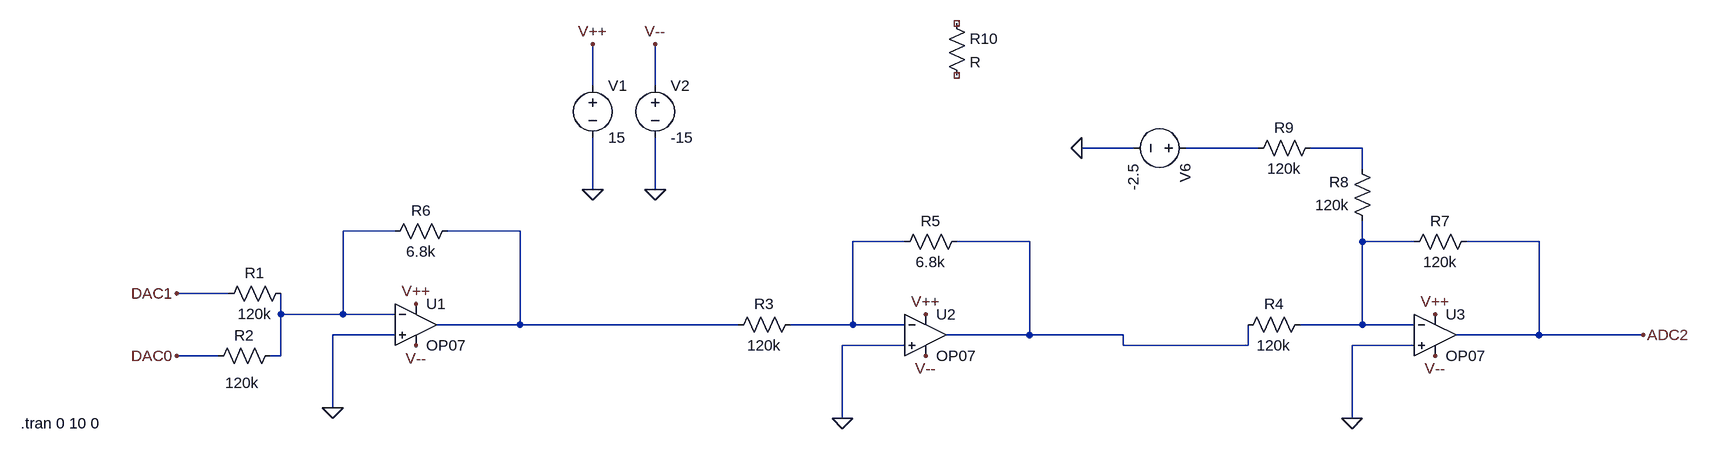
[diagram p0: schematic K_Circuit.asc]
K_Circuit.asc, the LTspice schematic file:
Version 4
SHEET 1 2016 680
WIRE 320 -272 320 -336
WIRE 416 -272 416 -336
WIRE 1152 -176 1072 -176
WIRE 1344 -176 1232 -176
WIRE 1504 -176 1424 -176
WIRE 1504 -144 1504 -176
WIRE 320 -112 320 -192
WIRE 416 -112 416 -192
WIRE 16 -48 -64 -48
WIRE 208 -48 96 -48
WIRE 800 -32 720 -32
WIRE 992 -32 880 -32
WIRE 1504 -32 1504 -64
WIRE 1584 -32 1504 -32
WIRE 1776 -32 1664 -32
WIRE -240 48 -320 48
WIRE -160 80 -160 48
WIRE -64 80 -64 -48
WIRE -64 80 -160 80
WIRE 16 80 -64 80
WIRE 208 96 208 -48
WIRE 208 96 80 96
WIRE 544 96 208 96
WIRE 720 96 720 -32
WIRE 720 96 624 96
WIRE 800 96 720 96
WIRE 1504 96 1504 -32
WIRE 1504 96 1408 96
WIRE 1584 96 1504 96
WIRE 16 112 -80 112
WIRE 992 112 992 -32
WIRE 992 112 864 112
WIRE 1136 112 992 112
WIRE 1776 112 1776 -32
WIRE 1776 112 1648 112
WIRE 1936 112 1776 112
WIRE 800 128 704 128
WIRE 1136 128 1136 112
WIRE 1328 128 1328 96
WIRE 1328 128 1136 128
WIRE 1584 128 1488 128
WIRE -256 144 -320 144
WIRE -160 144 -160 80
WIRE -160 144 -176 144
WIRE -80 224 -80 112
WIRE 704 240 704 128
WIRE 1488 240 1488 128
FLAG -320 48 DAC1
FLAG -320 144 DAC0
FLAG -80 224 0
FLAG 320 -112 0
FLAG 320 -336 V++
FLAG 416 -112 0
FLAG 416 -336 V--
FLAG 48 64 V++
FLAG 48 128 V--
FLAG 704 240 0
FLAG 832 80 V++
FLAG 832 144 V--
FLAG 1936 112 ADC2
FLAG 1488 240 0
FLAG 1616 80 V++
FLAG 1616 144 V--
FLAG 1072 -176 0
SYMBOL OpAmps\\OP07 48 32 R0
SYMATTR InstName U1
SYMBOL res -144 32 R90
WINDOW 0 0 56 VBottom 2
WINDOW 3 32 56 VTop 2
SYMATTR InstName R1
SYMATTR Value 120k
SYMBOL res -160 128 R90
WINDOW 0 0 56 VBottom 2
WINDOW 3 42 59 VTop 2
SYMATTR InstName R2
SYMATTR Value 120k
SYMBOL res 112 -64 R90
WINDOW 0 0 56 VBottom 2
WINDOW 3 32 56 VTop 2
SYMATTR InstName R6
SYMATTR Value 6.8k
SYMBOL voltage 320 -288 R0
WINDOW 123 0 0 Left 0
WINDOW 39 0 0 Left 0
SYMATTR InstName V1
SYMATTR Value 15
SYMBOL voltage 416 -288 R0
WINDOW 123 0 0 Left 0
WINDOW 39 0 0 Left 0
SYMATTR InstName V2
SYMATTR Value -15
SYMBOL OpAmps\\OP07 832 48 R0
SYMATTR InstName U2
SYMBOL res 640 80 R90
WINDOW 0 0 56 VBottom 2
WINDOW 3 32 56 VTop 2
SYMATTR InstName R3
SYMATTR Value 120k
SYMBOL res 896 -48 R90
WINDOW 0 0 56 VBottom 2
WINDOW 3 32 56 VTop 2
SYMATTR InstName R5
SYMATTR Value 6.8k
SYMBOL OpAmps\\OP07 1616 48 R0
SYMATTR InstName U3
SYMBOL res 1424 80 R90
WINDOW 0 0 56 VBottom 2
WINDOW 3 32 56 VTop 2
SYMATTR InstName R4
SYMATTR Value 120k
SYMBOL res 1680 -48 R90
WINDOW 0 0 56 VBottom 2
WINDOW 3 32 56 VTop 2
SYMATTR InstName R7
SYMATTR Value 120k
SYMBOL voltage 1248 -176 R90
WINDOW 123 0 0 Left 0
WINDOW 39 0 0 Left 0
SYMATTR InstName V6
SYMATTR Value -2.5
SYMBOL res 1520 -48 R180
WINDOW 0 36 76 Left 2
WINDOW 3 36 40 Left 2
SYMATTR InstName R8
SYMATTR Value 120k
SYMBOL res 1328 -160 R270
WINDOW 0 32 56 VTop 2
WINDOW 3 0 56 VBottom 2
SYMATTR InstName R9
SYMATTR Value 120k
SYMBOL res 864 -384 R0
SYMATTR InstName R10
TEXT -560 248 Left 2 !.tran 0 10 0

The netlist it stands for:
* K_Circuit.asc
XU1 0 N003 V++ V-- N004 LT1001  ; OP07, pins In+ In- V+ V- OUT
R1 N003 DAC1 120k
R2 N003 DAC0 120k
R6 N004 N003 6.8k
V1 V++ 0 15
V2 V-- 0 -15
XU2 0 N005 V++ V-- N006 LT1001  ; OP07, pins In+ In- V+ V- OUT
R3 N005 N004 120k
R5 N006 N005 6.8k
XU3 0 N007 V++ V-- ADC2 LT1001  ; OP07, pins In+ In- V+ V- OUT
R4 N007 N006 120k
R7 ADC2 N007 120k
V6 N001 0 -2.5
R8 N007 N002 120k
R9 N001 N002 120k
R10 NC_01 NC_02 R
.tran 0 10 0
.lib LTC.lib
.backanno
.end